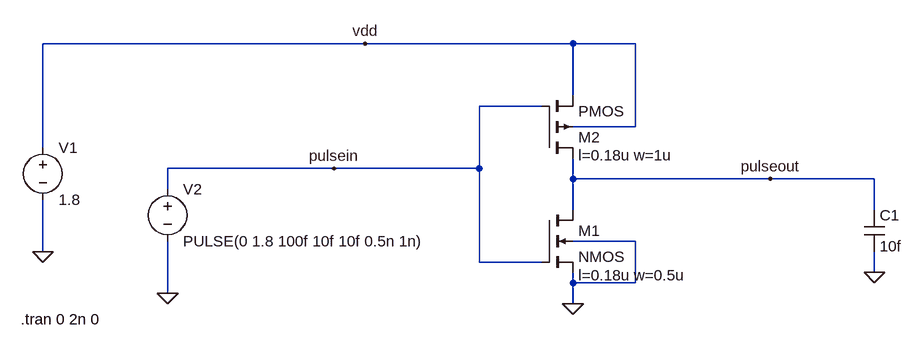
[diagram p0: schematic inverter_model_check.asc]
inverter_model_check.asc, the LTspice schematic file:
Version 4
SHEET 1 880 680
WIRE -112 -80 -608 -80
WIRE 208 -80 -112 -80
WIRE 304 -80 208 -80
WIRE 208 0 208 -80
WIRE 160 16 64 16
WIRE 304 48 304 -80
WIRE 304 48 208 48
WIRE -608 80 -608 -80
WIRE -160 112 -416 112
WIRE 64 112 64 16
WIRE 64 112 -160 112
WIRE 208 128 208 96
WIRE 512 128 208 128
WIRE 672 128 512 128
WIRE -416 144 -416 112
WIRE 208 176 208 128
WIRE 672 176 672 128
WIRE 304 224 208 224
WIRE -608 240 -608 160
WIRE 64 256 64 112
WIRE 160 256 64 256
WIRE 672 272 672 240
WIRE 208 288 208 272
WIRE 304 288 304 224
WIRE 304 288 208 288
WIRE -416 304 -416 224
WIRE 208 320 208 288
FLAG -608 240 0
FLAG 208 320 0
FLAG -416 304 0
FLAG 672 272 0
FLAG -160 112 pulsein
FLAG 512 128 pulseout
FLAG -112 -80 vdd
SYMBOL nmos4 160 176 R0
WINDOW 123 56 100 Left 2
SYMATTR InstName M1
SYMATTR Value2 l=0.18u w=0.5u
SYMBOL pmos4 160 96 M180
WINDOW 123 56 4 Left 2
SYMATTR InstName M2
SYMATTR Value2 l=0.18u w=1u
SYMBOL voltage -608 64 R0
WINDOW 123 0 0 Left 0
WINDOW 39 0 0 Left 0
SYMATTR InstName V1
SYMATTR Value 1.8
SYMBOL voltage -416 128 R0
WINDOW 123 0 0 Left 0
WINDOW 39 0 0 Left 0
SYMATTR InstName V2
SYMATTR Value PULSE(0 1.8 100f 10f 10f 0.5n 1n)
SYMBOL cap 656 176 R0
SYMATTR InstName C1
SYMATTR Value 10f
TEXT -642 344 Left 2 !.tran 0 2n 0

The netlist it stands for:
* inverter_model_check.asc
M1 pulseout pulsein 0 0 NMOS l=0.18u w=0.5u
M2 pulseout pulsein vdd vdd PMOS l=0.18u w=1u
V1 vdd 0 1.8
V2 pulsein 0 PULSE(0 1.8 100f 10f 10f 0.5n 1n)
C1 pulseout 0 10f
.model NMOS NMOS
.model PMOS PMOS
.lib standard.mos
.tran 0 2n 0
.backanno
.end